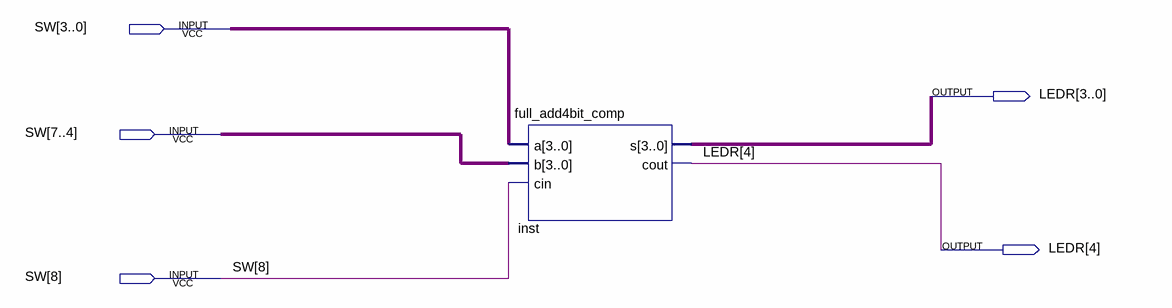
[diagram p0: schematic sheet]
// Quartus schematic additionneur_4bitsbdf.bdf as structural Verilog: 1 symbols, 5 pins
module additionneur_4bitsbdf (
  input  [8:0] SW,
  output [4:0] LEDR
);

  full_add4bit_comp inst (.a(SW[3:0]), .b(SW[7:4]), .cin(SW[8]), .s(LEDR[3:0]), .cout(LEDR[4]));
endmodule
